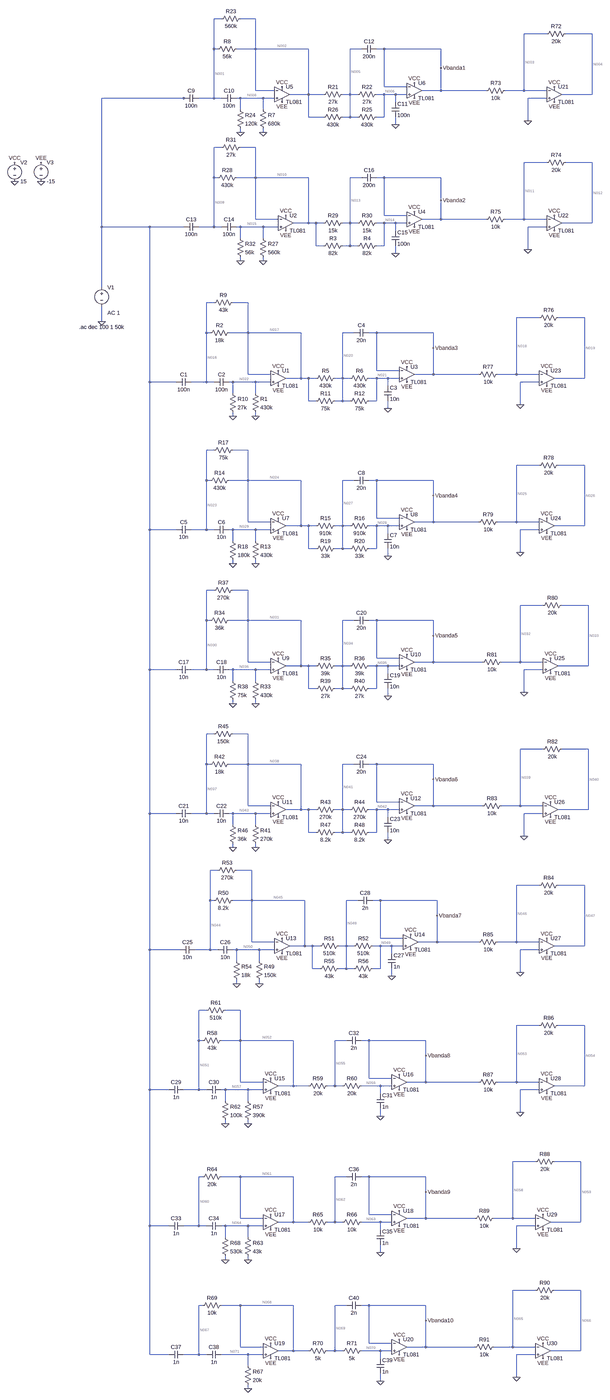
[diagram p0: schematic Filtros.asc, whole sheet]
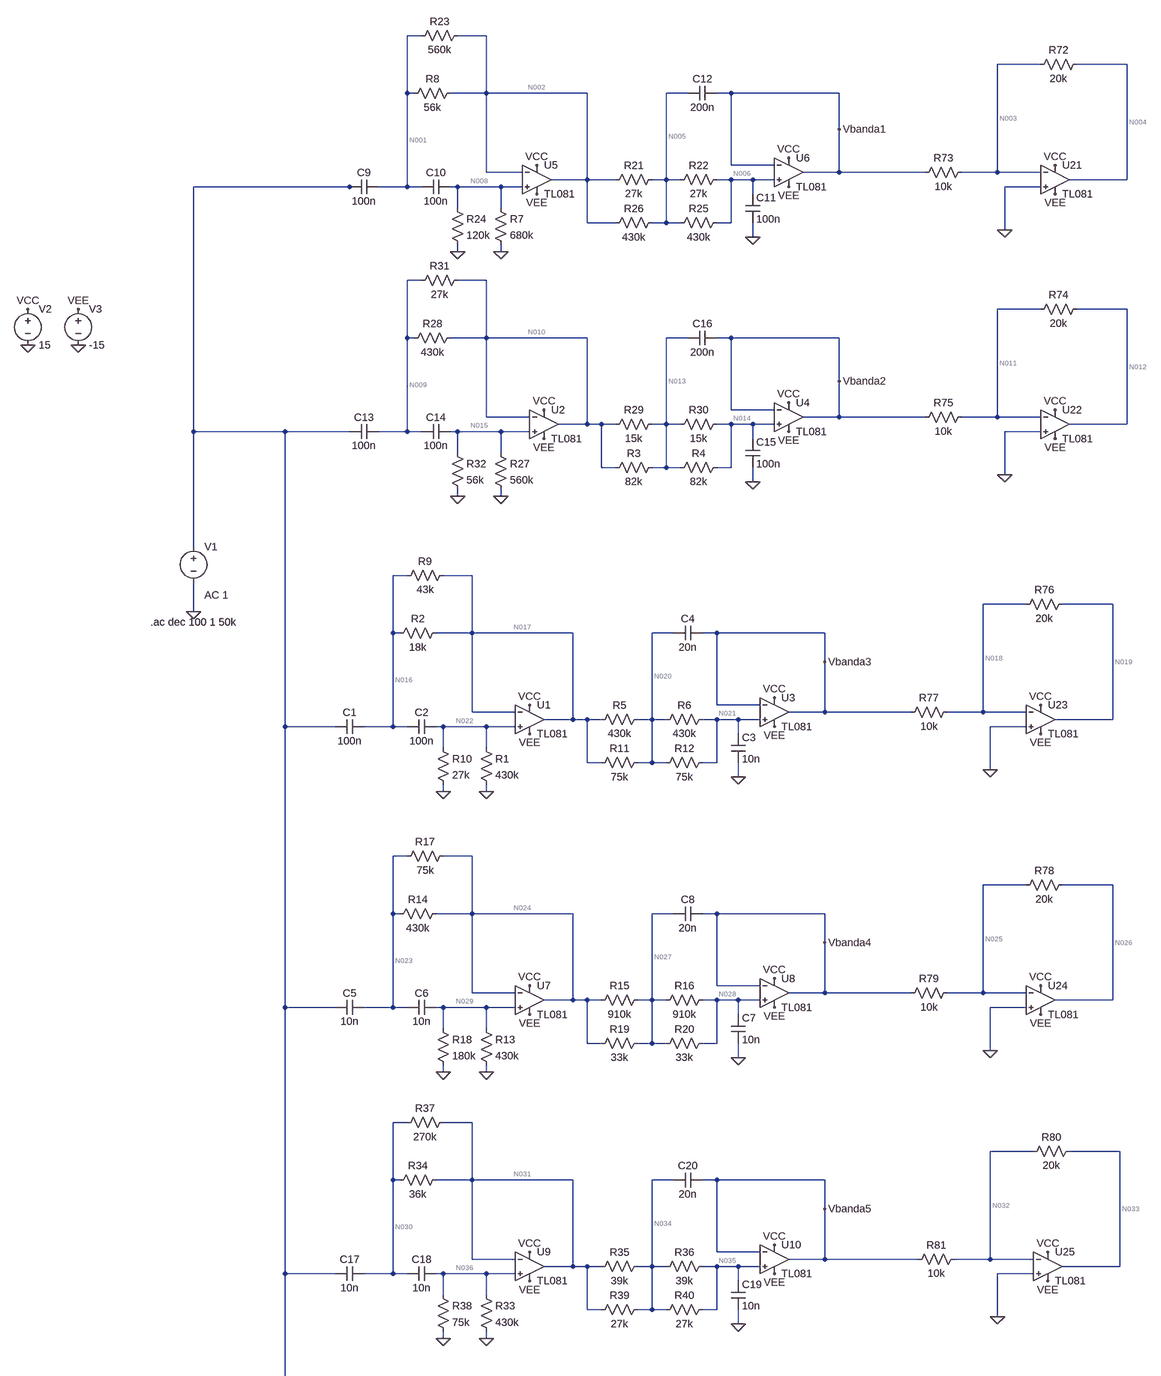
[diagram p1: schematic Filtros.asc, part, row 1 of 2, column 1 of 1]
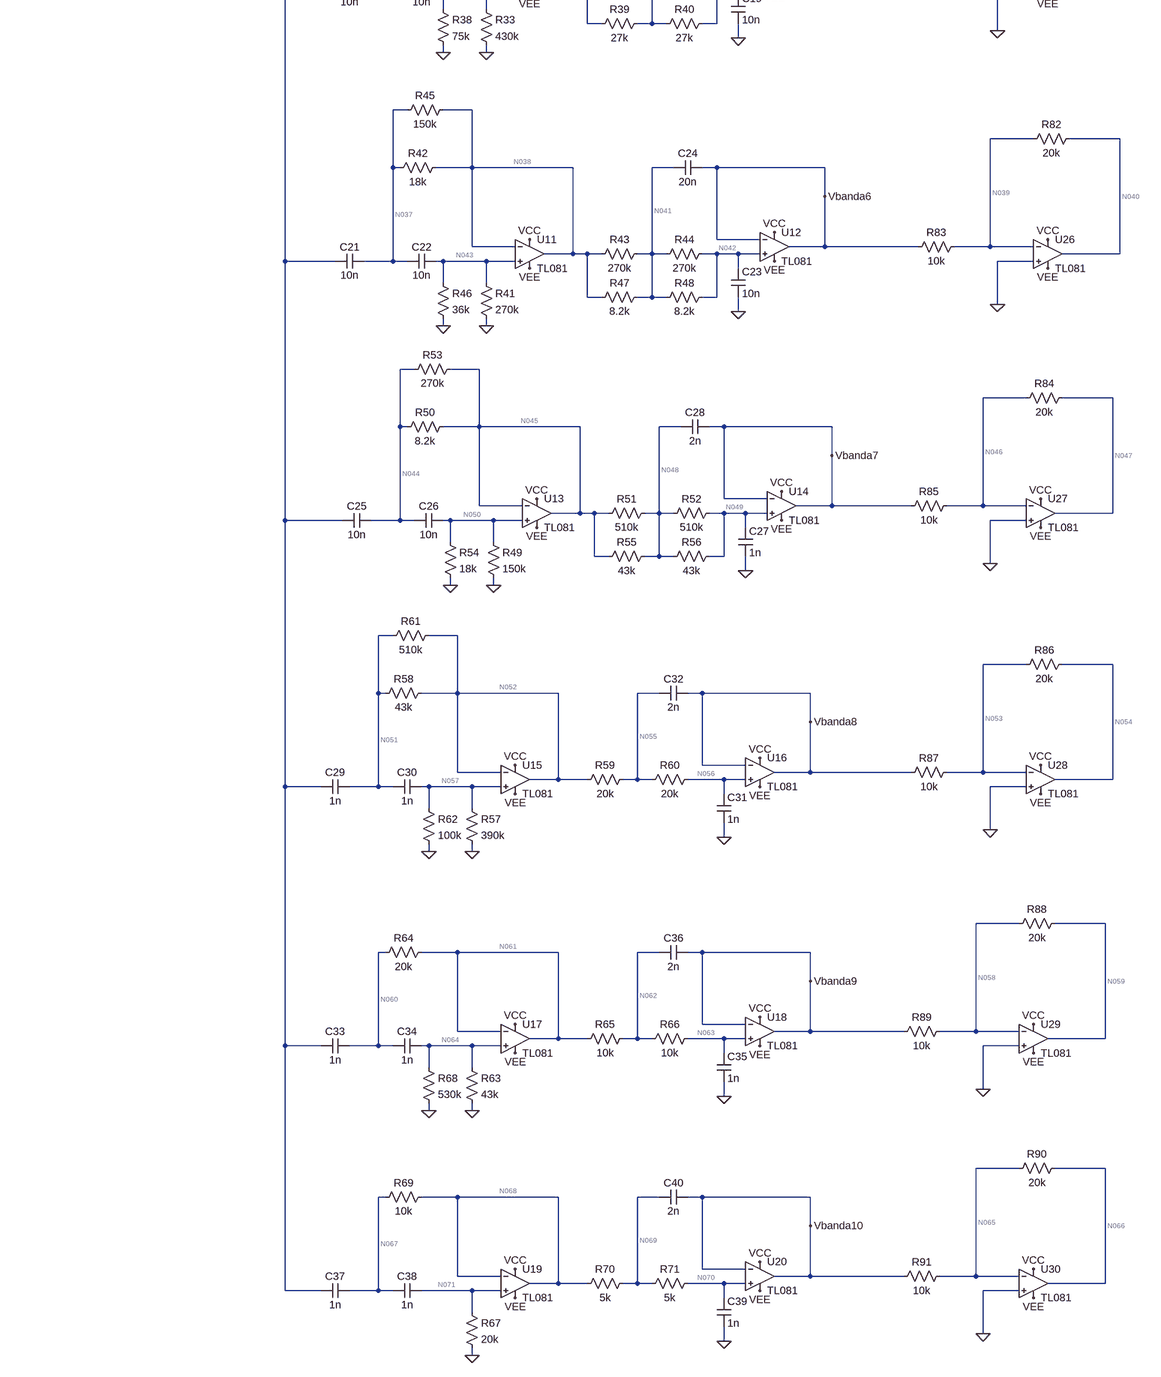
[diagram p2: schematic Filtros.asc, part, row 2 of 2, column 1 of 1]
* Filtros.asc
V1 N007 0 AC 1
V2 VCC 0 15
V3 VEE 0 -15
C9 N001 N007 100n
C10 N008 N001 100n
R7 N008 0 680k
R8 N002 N001 56k
R21 N005 N002 27k
R22 N006 N005 27k
C11 N006 0 100n
C12 Vbanda1 N005 200n
R23 N002 N001 560k
R24 N008 0 120k
R25 N006 N005 430k
R26 N005 N002 430k
C13 N009 N007 100n
C14 N015 N009 100n
R27 N015 0 560k
R28 N010 N009 430k
R29 N013 N010 15k
R30 N014 N013 15k
C15 N014 0 100n
C16 Vbanda2 N013 200n
R31 N010 N009 27k
R32 N015 0 56k
* U2: TL081 (symbol AutoGenerated\TL081 not available, pins judged from their places): In+=N015 In-=N010 V+=VCC V-=VEE OUT=N010
* U4: TL081 (symbol AutoGenerated\TL081 not available, pins judged from their places): In+=N014 In-=Vbanda2 V+=VCC V-=VEE OUT=Vbanda2
* U5: TL081 (symbol AutoGenerated\TL081 not available, pins judged from their places): In+=N008 In-=N002 V+=VCC V-=VEE OUT=N002
* U6: TL081 (symbol AutoGenerated\TL081 not available, pins judged from their places): In+=N006 In-=Vbanda1 V+=VCC V-=VEE OUT=Vbanda1
R3 N013 N010 82k
R4 N014 N013 82k
C1 N016 N007 100n
C2 N022 N016 100n
R1 N022 0 430k
R2 N017 N016 18k
R5 N020 N017 430k
R6 N021 N020 430k
C3 N021 0 10n
C4 Vbanda3 N020 20n
R9 N017 N016 43k
R10 N022 0 27k
* U1: TL081 (symbol AutoGenerated\TL081 not available, pins judged from their places): In+=N022 In-=N017 V+=VCC V-=VEE OUT=N017
* U3: TL081 (symbol AutoGenerated\TL081 not available, pins judged from their places): In+=N021 In-=Vbanda3 V+=VCC V-=VEE OUT=Vbanda3
R11 N020 N017 75k
R12 N021 N020 75k
C5 N023 N007 10n
C6 N029 N023 10n
R13 N029 0 430k
R14 N024 N023 430k
R15 N027 N024 910k
R16 N028 N027 910k
C7 N028 0 10n
C8 Vbanda4 N027 20n
R17 N024 N023 75k
R18 N029 0 180k
* U7: TL081 (symbol AutoGenerated\TL081 not available, pins judged from their places): In+=N029 In-=N024 V+=VCC V-=VEE OUT=N024
* U8: TL081 (symbol AutoGenerated\TL081 not available, pins judged from their places): In+=N028 In-=Vbanda4 V+=VCC V-=VEE OUT=Vbanda4
R19 N027 N024 33k
R20 N028 N027 33k
C17 N030 N007 10n
C18 N036 N030 10n
R33 N036 0 430k
R34 N031 N030 36k
R35 N034 N031 39k
R36 N035 N034 39k
C19 N035 0 10n
C20 Vbanda5 N034 20n
R37 N031 N030 270k
R38 N036 0 75k
* U9: TL081 (symbol AutoGenerated\TL081 not available, pins judged from their places): In+=N036 In-=N031 V+=VCC V-=VEE OUT=N031
* U10: TL081 (symbol AutoGenerated\TL081 not available, pins judged from their places): In+=N035 In-=Vbanda5 V+=VCC V-=VEE OUT=Vbanda5
R39 N034 N031 27k
R40 N035 N034 27k
C21 N037 N007 10n
C22 N043 N037 10n
R41 N043 0 270k
R42 N038 N037 18k
R43 N041 N038 270k
R44 N042 N041 270k
C23 N042 0 10n
C24 Vbanda6 N041 20n
R45 N038 N037 150k
R46 N043 0 36k
* U11: TL081 (symbol AutoGenerated\TL081 not available, pins judged from their places): In+=N043 In-=N038 V+=VCC V-=VEE OUT=N038
* U12: TL081 (symbol AutoGenerated\TL081 not available, pins judged from their places): In+=N042 In-=Vbanda6 V+=VCC V-=VEE OUT=Vbanda6
R47 N041 N038 8.2k
R48 N042 N041 8.2k
C25 N044 N007 10n
C26 N050 N044 10n
R49 N050 0 150k
R50 N045 N044 8.2k
R51 N048 N045 510k
R52 N049 N048 510k
C27 N049 0 1n
C28 Vbanda7 N048 2n
R53 N045 N044 270k
R54 N050 0 18k
* U13: TL081 (symbol AutoGenerated\TL081 not available, pins judged from their places): In+=N050 In-=N045 V+=VCC V-=VEE OUT=N045
* U14: TL081 (symbol AutoGenerated\TL081 not available, pins judged from their places): In+=N049 In-=Vbanda7 V+=VCC V-=VEE OUT=Vbanda7
R55 N048 N045 43k
R56 N049 N048 43k
C29 N051 N007 1n
C30 N057 N051 1n
R57 N057 0 390k
R58 N052 N051 43k
R59 N055 N052 20k
R60 N056 N055 20k
C31 N056 0 1n
C32 Vbanda8 N055 2n
R61 N052 N051 510k
R62 N057 0 100k
* U15: TL081 (symbol AutoGenerated\TL081 not available, pins judged from their places): In+=N057 In-=N052 V+=VCC V-=VEE OUT=N052
* U16: TL081 (symbol AutoGenerated\TL081 not available, pins judged from their places): In+=N056 In-=Vbanda8 V+=VCC V-=VEE OUT=Vbanda8
C33 N060 N007 1n
C34 N064 N060 1n
R63 N064 0 43k
R64 N061 N060 20k
R65 N062 N061 10k
R66 N063 N062 10k
C35 N063 0 1n
C36 Vbanda9 N062 2n
R68 N064 0 530k
* U17: TL081 (symbol AutoGenerated\TL081 not available, pins judged from their places): In+=N064 In-=N061 V+=VCC V-=VEE OUT=N061
* U18: TL081 (symbol AutoGenerated\TL081 not available, pins judged from their places): In+=N063 In-=Vbanda9 V+=VCC V-=VEE OUT=Vbanda9
C37 N067 N007 1n
C38 N071 N067 1n
R67 N071 0 20k
R69 N068 N067 10k
R70 N069 N068 5k
R71 N070 N069 5k
C39 N070 0 1n
C40 Vbanda10 N069 2n
* U19: TL081 (symbol AutoGenerated\TL081 not available, pins judged from their places): In+=N071 In-=N068 V+=VCC V-=VEE OUT=N068
* U20: TL081 (symbol AutoGenerated\TL081 not available, pins judged from their places): In+=N070 In-=Vbanda10 V+=VCC V-=VEE OUT=Vbanda10
* U21: TL081 (symbol AutoGenerated\TL081 not available, pins judged from their places): In+=0 In-=N003 V+=VCC V-=VEE OUT=N004
R72 N004 N003 20k
R73 N003 Vbanda1 10k
* U22: TL081 (symbol AutoGenerated\TL081 not available, pins judged from their places): In+=0 In-=N011 V+=VCC V-=VEE OUT=N012
R74 N012 N011 20k
R75 N011 Vbanda2 10k
* U23: TL081 (symbol AutoGenerated\TL081 not available, pins judged from their places): In+=0 In-=N018 V+=VCC V-=VEE OUT=N019
R76 N019 N018 20k
R77 N018 Vbanda3 10k
* U24: TL081 (symbol AutoGenerated\TL081 not available, pins judged from their places): In+=0 In-=N025 V+=VCC V-=VEE OUT=N026
R78 N026 N025 20k
R79 N025 Vbanda4 10k
* U25: TL081 (symbol AutoGenerated\TL081 not available, pins judged from their places): In+=0 In-=N032 V+=VCC V-=VEE OUT=N033
R80 N033 N032 20k
R81 N032 Vbanda5 10k
* U26: TL081 (symbol AutoGenerated\TL081 not available, pins judged from their places): In+=0 In-=N039 V+=VCC V-=VEE OUT=N040
R82 N040 N039 20k
R83 N039 Vbanda6 10k
* U27: TL081 (symbol AutoGenerated\TL081 not available, pins judged from their places): In+=0 In-=N046 V+=VCC V-=VEE OUT=N047
R84 N047 N046 20k
R85 N046 Vbanda7 10k
* U28: TL081 (symbol AutoGenerated\TL081 not available, pins judged from their places): In+=0 In-=N053 V+=VCC V-=VEE OUT=N054
R86 N054 N053 20k
R87 N053 Vbanda8 10k
* U29: TL081 (symbol AutoGenerated\TL081 not available, pins judged from their places): In+=0 In-=N058 V+=VCC V-=VEE OUT=N059
R88 N059 N058 20k
R89 N058 Vbanda9 10k
* U30: TL081 (symbol AutoGenerated\TL081 not available, pins judged from their places): In+=0 In-=N065 V+=VCC V-=VEE OUT=N066
R90 N066 N065 20k
R91 N065 Vbanda10 10k
.ac dec 100 1 50k
.backanno
.end

* Results of the author's LTspice run, read from the files saved beside the schematic
* Operating Point, zero values left out:
*   V(vcc) = 15 V
*   V(vee) = -15 V
*   V(n001) = 6.375 µV
*   V(n008) = -4.595 µV
*   V(n002) = 6.375 µV
*   V(n005) = 5.231 µV
*   V(n006) = 4.086 µV
*   V(vbanda1) = 15.06 µV
*   V(n009) = 8.677 µV
*   V(n015) = -2.294 µV
*   V(n010) = 8.677 µV
*   V(n013) = 8.106 µV
*   V(n014) = 7.535 µV
*   V(vbanda2) = 18.5 µV
*   V(n016) = 9.826 µV
*   V(n022) = -1.145 µV
*   V(n017) = 9.826 µV
*   V(n020) = 6.949 µV
*   V(n021) = 4.072 µV
*   V(vbanda3) = 15.04 µV
*   V(n023) = 5.254 µV
*   V(n029) = -5.717 µV
*   V(n024) = 5.254 µV
*   V(n027) = 3.82 µV
*   V(n028) = 2.385 µV
*   V(vbanda4) = 13.36 µV
*   V(n030) = 8.094 µV
*   V(n036) = -2.877 µV
*   V(n031) = 8.094 µV
*   V(n034) = 7.375 µV
*   V(n035) = 6.656 µV
*   V(vbanda5) = 17.63 µV
*   V(n037) = 9.54 µV
*   V(n043) = -1.431 µV
*   V(n038) = 9.54 µV
*   V(n041) = 9.181 µV
*   V(n042) = 8.823 µV
*   V(vbanda6) = 19.79 µV
*   V(n044) = 10.25 µV
*   V(n050) = -724.1 nV
*   V(n045) = 10.25 µV
*   V(n048) = 8.46 µV
*   V(n049) = 6.673 µV
*   V(vbanda7) = 17.64 µV
*   V(n051) = 7.385 µV
*   V(n057) = -3.586 µV
*   V(n052) = 7.385 µV
*   V(n055) = 6.484 µV
*   V(n056) = 5.583 µV
*   V(vbanda8) = 16.55 µV
*   V(n060) = 9.179 µV
*   V(n064) = -1.792 µV
*   V(n061) = 9.179 µV
*   V(n062) = 8.728 µV
*   V(n063) = 8.278 µV
*   V(vbanda9) = 19.25 µV
*   V(n067) = 10.07 µV
*   V(n071) = -901.1 nV
*   V(n068) = 10.07 µV
*   V(n069) = 9.844 µV
*   V(n070) = 9.619 µV
*   V(vbanda10) = 20.59 µV
*   V(n004) = 3.7 µV
*   V(n003) = 10.97 µV
*   V(n012) = -3.197 µV
*   V(n011) = 10.97 µV
*   V(n019) = 3.728 µV
*   V(n018) = 10.97 µV
*   V(n026) = 7.102 µV
*   V(n025) = 10.97 µV
*   V(n033) = -1.44 µV
*   V(n032) = 10.97 µV
*   V(n040) = -5.773 µV
*   V(n039) = 10.97 µV
*   V(n047) = -1.474 µV
*   V(n046) = 10.97 µV
*   V(n054) = 706.7 nV
*   V(n053) = 10.97 µV
*   V(n059) = -4.683 µV
*   V(n058) = 10.97 µV
*   V(n066) = -7.366 µV
*   V(n065) = 10.97 µV
*   I(R91) = -961.9 pA
*   I(R90) = -916.8 pA
*   I(R89) = -827.7 pA
*   I(R88) = -782.7 pA
*   I(R87) = -558.3 pA
*   I(R86) = -513.2 pA
*   I(R85) = -667.3 pA
*   I(R84) = -622.3 pA
*   I(R83) = -882.2 pA
*   I(R82) = -837.2 pA
*   I(R81) = -665.6 pA
*   I(R80) = -620.5 pA
*   I(R79) = -238.5 pA
*   I(R78) = -193.4 pA
*   I(R77) = -407.2 pA
*   I(R76) = -362.1 pA
*   I(R75) = -753.4 pA
*   I(R74) = -708.4 pA
*   I(R73) = -408.6 pA
*   I(R72) = -363.6 pA
*   I(R71) = -45.05 pA
*   I(R70) = -45.05 pA
*   I(R67) = -45.05 pA
*   I(R68) = -3.381 pA
*   I(R66) = -45.05 pA
*   I(R65) = -45.05 pA
*   I(R63) = -41.67 pA
*   I(R62) = -35.86 pA
*   I(R60) = -45.05 pA
*   I(R59) = -45.05 pA
*   I(R57) = -9.195 pA
*   I(R56) = -41.55 pA
*   I(R55) = -41.55 pA
*   I(R54) = -40.23 pA
*   I(R52) = -3.503 pA
*   I(R51) = -3.503 pA
*   I(R49) = -4.827 pA
*   I(R48) = -43.73 pA
*   I(R47) = -43.73 pA
*   I(R46) = -39.75 pA
*   I(R44) = -1.328 pA
*   I(R43) = -1.328 pA
*   I(R41) = -5.3 pA
*   I(R40) = -26.62 pA
*   I(R39) = -26.62 pA
*   I(R38) = -38.36 pA
*   I(R36) = -18.43 pA
*   I(R35) = -18.43 pA
*   I(R33) = -6.691 pA
*   I(R20) = -43.48 pA
*   I(R19) = -43.48 pA
*   I(R18) = -31.76 pA
*   I(R16) = -1.577 pA
*   I(R15) = -1.577 pA
*   I(R13) = -13.29 pA
*   I(R12) = -38.36 pA
*   I(R11) = -38.36 pA
*   I(R10) = -42.39 pA
*   I(R6) = -6.691 pA
*   I(R5) = -6.691 pA
*   I(R1) = -2.662 pA
*   I(R4) = -6.967 pA
*   I(R3) = -6.967 pA
*   I(R32) = -40.96 pA
*   I(R30) = -38.09 pA
*   I(R29) = -38.09 pA
*   I(R27) = -4.096 pA
*   I(R26) = -2.662 pA
*   I(R25) = -2.662 pA
*   I(R24) = -38.3 pA
*   I(R22) = -42.39 pA
*   I(R21) = -42.39 pA
*   I(R7) = -6.758 pA
*   I(V3) = 425.8 mA
*   I(V2) = -425.8 mA
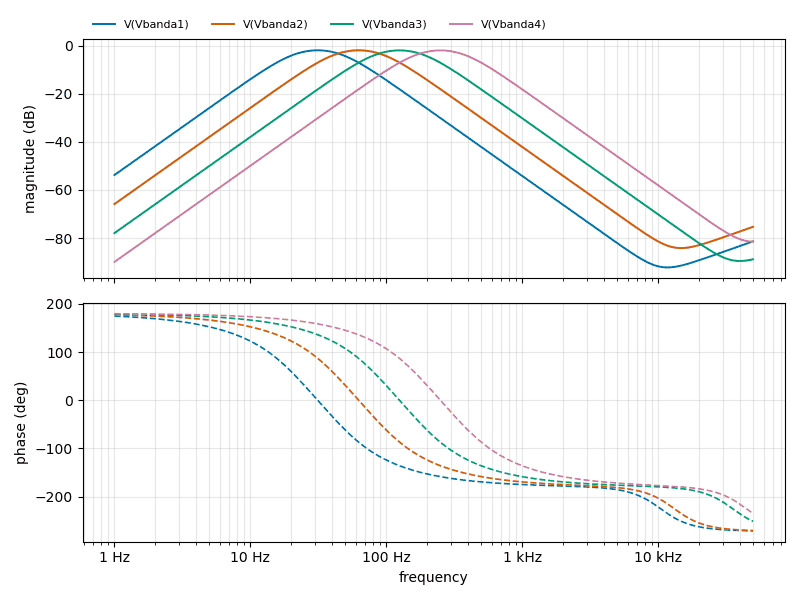
[diagram p3: AC Analysis of Filtros.asc, plotted from the saved traces]
* AC Analysis, 1 run:
*   V(Vbanda1): -53.77 dB at 1 Hz, -81.34 dB at 50 kHz, peak -1.92 dB at 31.62 Hz, 3 dB below the peak at 18.51 Hz and 52.83 Hz
*   V(Vbanda2): -65.84 dB at 1 Hz, -75.31 dB at 50 kHz, peak -1.92 dB at 63.1 Hz, 3 dB below the peak at 37.09 Hz and 105.8 Hz
*   V(Vbanda3): -77.91 dB at 1 Hz, -88.80 dB at 50 kHz, peak -1.96 dB at 125.9 Hz, 3 dB below the peak at 74.12 Hz and 210.7 Hz
*   V(Vbanda4): -89.90 dB at 1 Hz, -81.46 dB at 50 kHz, peak -1.96 dB at 251.2 Hz, 3 dB below the peak at 148.1 Hz and 422.4 Hz